# EAGLE design MF2015 Vertical (EAGLE 7.1.0)
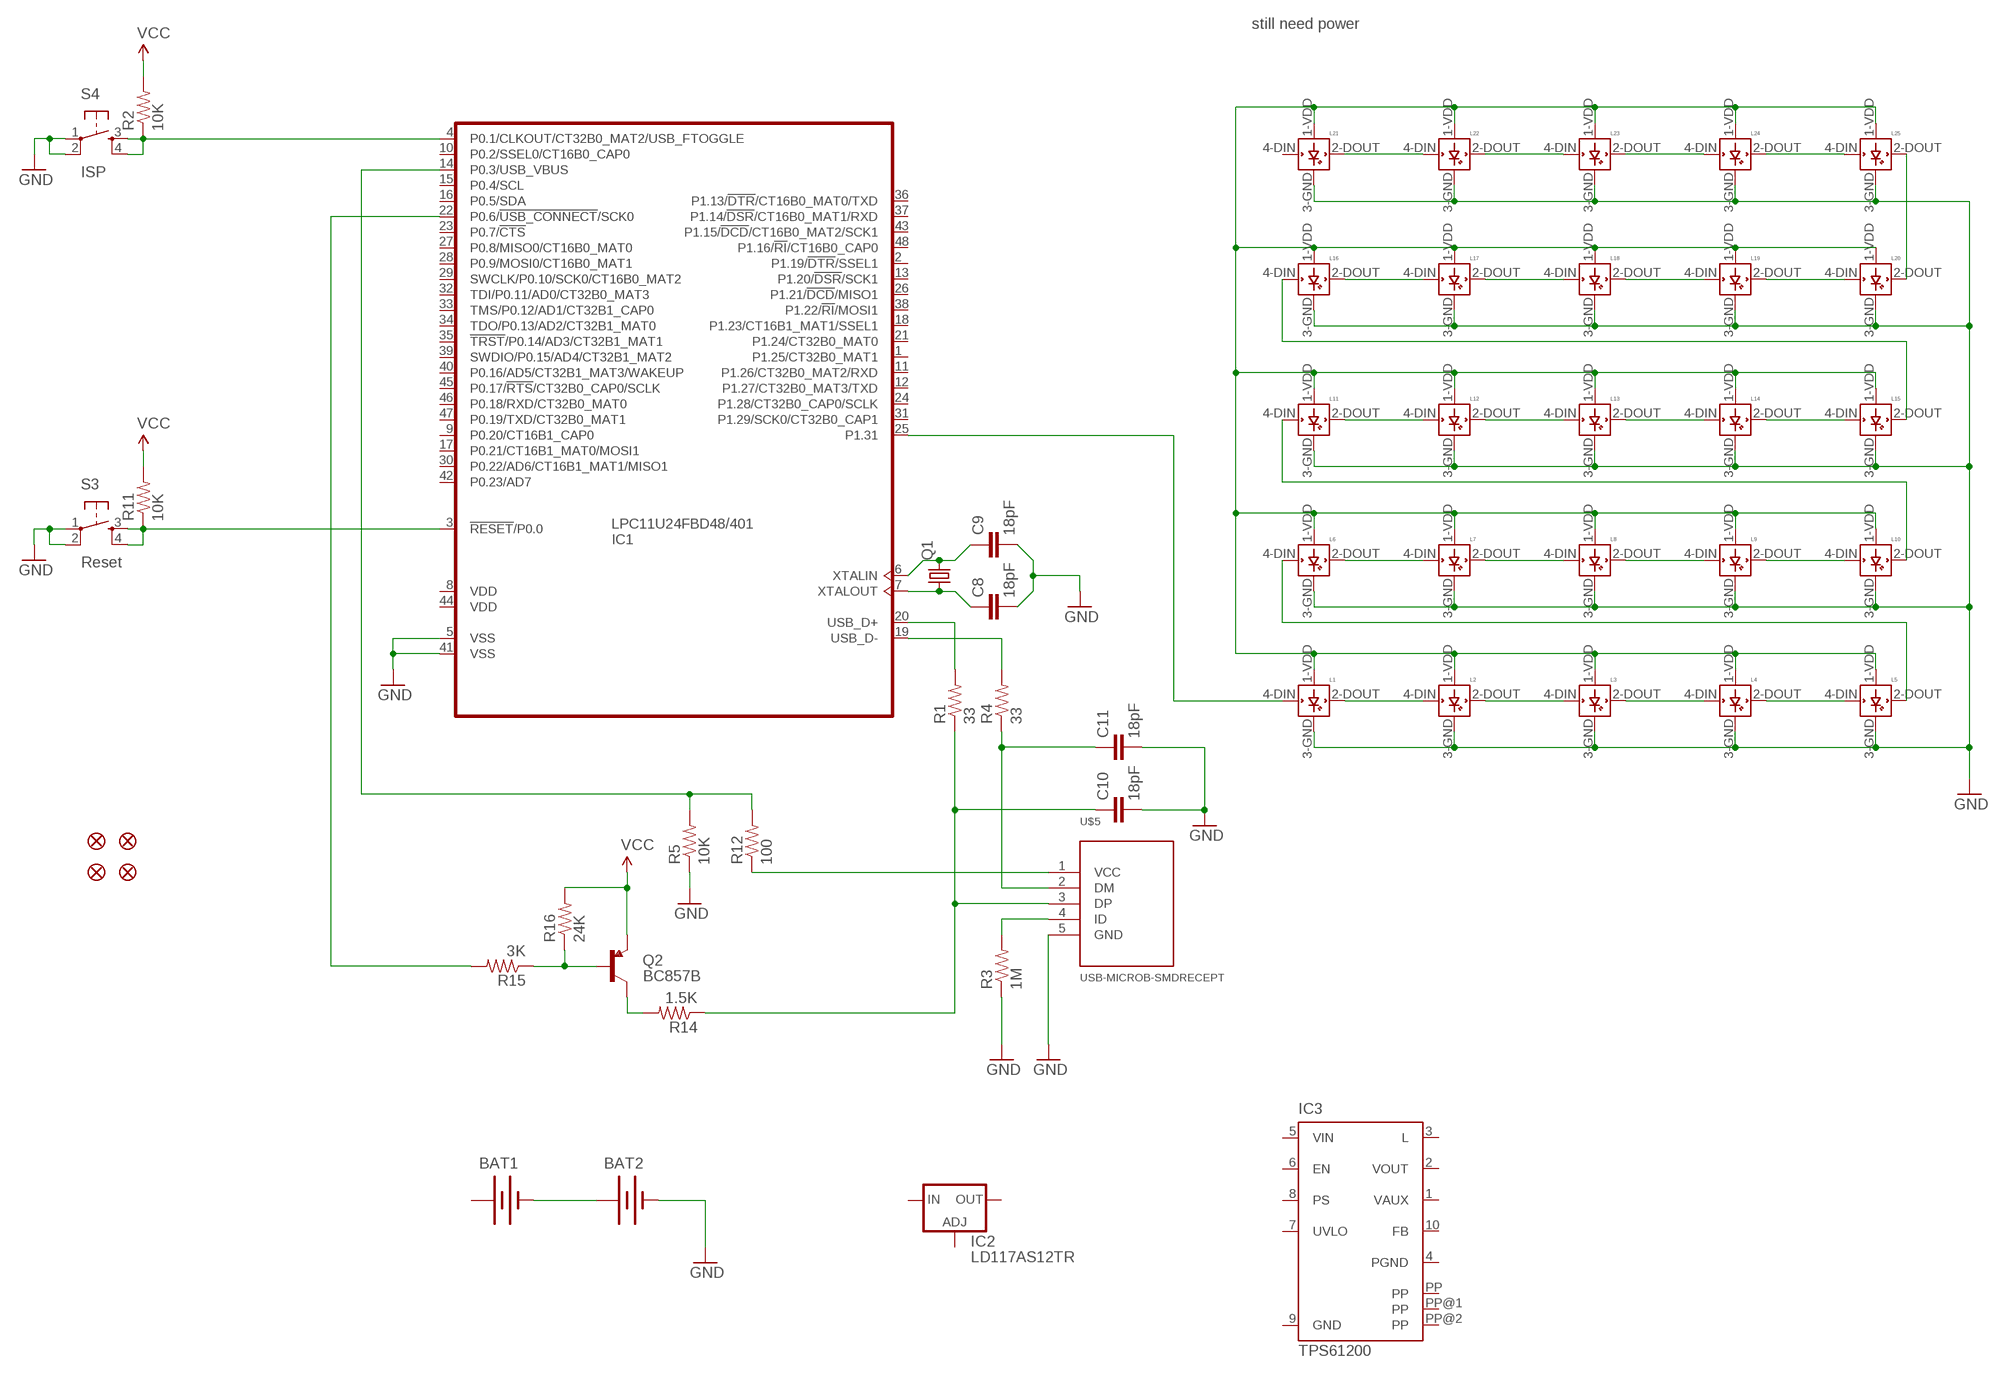
[diagram p0: schematic, sheet 1]

## Parts
BAT1  BATTERYAAA-KIT  [BATTERY-AAA-KIT]
BAT2  BATTERYAAA-KIT  [BATTERY-AAA-KIT]
C8  18pF  C-EUC0603  [C0603]
C9  18pF  C-EUC0603  [C0603]
C10  18pF  C-EUC0603  [C0603]
C11  18pF  C-EUC0603  [C0603]
FID1  FIDUCIAL1X2  [FIDUCIAL-1X2]
FID2  FIDUCIAL1X2  [FIDUCIAL-1X2]
FID3  FIDUCIAL1X2  [FIDUCIAL-1X2]
FID4  FIDUCIAL1X2  [FIDUCIAL-1X2]
IC1  LPC11U24FBD48/401  [LQFP48]
IC2  LD117AS12TR  [SOT223]
IC3  TPS61200  [S-PDSO-N10]
L1  WS2812B  [WS2812B]
L2  WS2812B  [WS2812B]
L3  WS2812B  [WS2812B]
L4  WS2812B  [WS2812B]
L5  WS2812B  [WS2812B]
L6  WS2812B  [WS2812B]
L7  WS2812B  [WS2812B]
L8  WS2812B  [WS2812B]
L9  WS2812B  [WS2812B]
L10  WS2812B  [WS2812B]
L11  WS2812B  [WS2812B]
L12  WS2812B  [WS2812B]
L13  WS2812B  [WS2812B]
L14  WS2812B  [WS2812B]
L15  WS2812B  [WS2812B]
L16  WS2812B  [WS2812B]
L17  WS2812B  [WS2812B]
L18  WS2812B  [WS2812B]
L19  WS2812B  [WS2812B]
L20  WS2812B  [WS2812B]
L21  WS2812B  [WS2812B]
L22  WS2812B  [WS2812B]
L23  WS2812B  [WS2812B]
L24  WS2812B  [WS2812B]
L25  WS2812B  [WS2812B]
Q1  CRYSTAL  [CRYSTAL-SMD-5X3.2-2PIN]
Q2  BC857B  TRANSISTOR_PNPSMD  [SOT23-3]
R1  33  R-US_R0603  [R0603]
R2  10K  R-US_R0603  [R0603]
R3  1M  R-US_R0603  [R0603]
R4  33  R-US_R0603  [R0603]
R5  10K  R-US_R0603  [R0603]
R11  10K  R-US_R0603  [R0603]
R12  100  R-US_R0603  [R0603]
R14  1.5K  R-US_R0603  [R0603]
R15  3K  R-US_R0603  [R0603]
R16  24K  R-US_R0603  [R0603]
S3  Reset  TAC_SWITCHSMD  [TACTILE_SWITCH_SMD]
S4  ISP  TAC_SWITCHSMD  [TACTILE_SWITCH_SMD]
U$5  USB-MICROB-SMDRECEPT  [USB-MICROB-RECEPT]

## Nets
GND: BAT2.GND@1(-) C8.2 C9.2 C10.2 C11.2 IC1.5(VSS) IC1.41(VSS) L1.3-GND(GND) L2.3-GND(GND) L3.3-GND(GND) L4.3-GND(GND) L5.3-GND(GND) L6.3-GND(GND) L7.3-GND(GND) L8.3-GND(GND) L9.3-GND(GND) L10.3-GND(GND) L11.3-GND(GND) L12.3-GND(GND) L13.3-GND(GND) L14.3-GND(GND) L15.3-GND(GND) L16.3-GND(GND) L17.3-GND(GND) L18.3-GND(GND) L19.3-GND(GND) L20.3-GND(GND) L21.3-GND(GND) L22.3-GND(GND) L23.3-GND(GND) L24.3-GND(GND) L25.3-GND(GND) R3.1 R5.1 S3.1 S3.2 S4.1 S4.2 U$5.5(GND)
N$1: L1.2-DOUT(DOUT) L2.4-DIN(DIN)
N$2: L2.2-DOUT(DOUT) L3.4-DIN(DIN)
N$3: L3.2-DOUT(DOUT) L4.4-DIN(DIN)
N$4: L4.2-DOUT(DOUT) L5.4-DIN(DIN)
N$5: L5.2-DOUT(DOUT) L6.4-DIN(DIN)
N$6: L6.2-DOUT(DOUT) L7.4-DIN(DIN)
N$7: L7.2-DOUT(DOUT) L8.4-DIN(DIN)
N$8: L8.2-DOUT(DOUT) L9.4-DIN(DIN)
N$9: L9.2-DOUT(DOUT) L10.4-DIN(DIN)
N$10: L10.2-DOUT(DOUT) L11.4-DIN(DIN)
N$11: L11.2-DOUT(DOUT) L12.4-DIN(DIN)
N$12: L12.2-DOUT(DOUT) L13.4-DIN(DIN)
N$13: L13.2-DOUT(DOUT) L14.4-DIN(DIN)
N$14: L14.2-DOUT(DOUT) L15.4-DIN(DIN)
N$15: L15.2-DOUT(DOUT) L16.4-DIN(DIN)
N$16: L16.2-DOUT(DOUT) L17.4-DIN(DIN)
N$17: L17.2-DOUT(DOUT) L18.4-DIN(DIN)
N$18: L18.2-DOUT(DOUT) L19.4-DIN(DIN)
N$19: L19.2-DOUT(DOUT) L20.4-DIN(DIN)
N$20: L20.2-DOUT(DOUT) L25.2-DOUT(DOUT)
N$21: L24.2-DOUT(DOUT) L25.4-DIN(DIN)
N$22: L23.2-DOUT(DOUT) L24.4-DIN(DIN)
N$23: L22.2-DOUT(DOUT) L23.4-DIN(DIN)
N$24: L21.2-DOUT(DOUT) L22.4-DIN(DIN)
N$25: C9.1 IC1.6(XTALIN) Q1.P$2
N$26: C8.1 IC1.7(XTALOUT) Q1.P$1
N$27: C10.1 R1.1 R14.1 U$5.3(DP)
N$28: IC1.4(P0.1/CLKOUT/CT32B0_MAT2/USB_FTOGGLE) R2.1 S4.3 S4.4
N$29: IC1.20(USB_D+) R1.2
N$30: IC1.3(!RESET!/P0.0) R11.1 S3.3 S3.4
N$31: IC1.19(USB_D-) R4.2
N$32: C11.1 R4.1 U$5.2(DM)
N$33: R12.1 U$5.1(VCC)
N$34: R3.2 U$5.4(ID)
N$35: Q2.1(B) R15.1 R16.1
N$36: Q2.3(C) R14.2
N$37: BAT1.GND@1(-) BAT2.PWR@1(+)
N$38: IC1.25(P1.31) L1.4-DIN(DIN)
N$45: L1.1-VDD(VDD) L2.1-VDD(VDD) L3.1-VDD(VDD) L4.1-VDD(VDD) L5.1-VDD(VDD) L6.1-VDD(VDD) L7.1-VDD(VDD) L8.1-VDD(VDD) L9.1-VDD(VDD) L10.1-VDD(VDD) L11.1-VDD(VDD) L12.1-VDD(VDD) L13.1-VDD(VDD) L14.1-VDD(VDD) L15.1-VDD(VDD) L16.1-VDD(VDD) L17.1-VDD(VDD) L18.1-VDD(VDD) L19.1-VDD(VDD) L20.1-VDD(VDD) L21.1-VDD(VDD) L22.1-VDD(VDD) L23.1-VDD(VDD) L24.1-VDD(VDD) L25.1-VDD(VDD)
USB_CONNECT: IC1.22(P0.6/!USB_CONNECT!/SCK0) R15.2
USB_VBUS: IC1.14(P0.3/USB_VBUS) R5.2 R12.2
VCC: Q2.2(E) R2.2 R11.2 R16.2
Unconnected: IC1.1(P1.25/CT32B0_MAT1) IC1.2(P1.19/!DTR!/SSEL1) IC1.8(VDD) IC1.9(P0.20/CT16B1_CAP0) IC1.10(P0.2/SSEL0/CT16B0_CAP0) IC1.11(P1.26/CT32B0_MAT2/RXD) IC1.12(P1.27/CT32B0_MAT3/TXD) IC1.13(P1.20/!DSR!/SCK1) IC1.15(P0.4/SCL) IC1.16(P0.5/SDA) IC1.17(P0.21/CT16B1_MAT0/MOSI1) IC1.18(P1.23/CT16B1_MAT1/SSEL1) IC1.21(P1.24/CT32B0_MAT0) IC1.23(P0.7/!CTS!) IC1.24(P1.28/CT32B0_CAP0/SCLK) IC1.26(P1.21/!DCD!/MISO1) IC1.27(P0.8/MISO0/CT16B0_MAT0) IC1.28(P0.9/MOSI0/CT16B0_MAT1) IC1.29(SWCLK/P0.10/SCK0/CT16B0_MAT2) IC1.30(P0.22/AD6/CT16B1_MAT1/MISO1) IC1.31(P1.29/SCK0/CT32B0_CAP1) IC1.32(TDI/P0.11/AD0/CT32B0_MAT3) IC1.33(TMS/P0.12/AD1/CT32B1_CAP0) IC1.34(TDO/P0.13/AD2/CT32B1_MAT0) IC1.35(!TRST!/P0.14/AD3/CT32B1_MAT1) IC1.36(P1.13/!DTR!/CT16B0_MAT0/TXD) IC1.37(P1.14/!DSR!/CT16B0_MAT1/RXD) IC1.38(P1.22/!RI!/MOSI1) IC1.39(SWDIO/P0.15/AD4/CT32B1_MAT2) IC1.40(P0.16/AD5/CT32B1_MAT3/WAKEUP) IC1.42(P0.23/AD7) IC1.43(P1.15/!DCD!/CT16B0_MAT2/SCK1) IC1.44(VDD) IC1.45(P0.17/!RTS!/CT32B0_CAP0/SCLK) IC1.46(P0.18/RXD/CT32B0_MAT0) IC1.47(P0.19/TXD/CT32B0_MAT1) IC1.48(P1.16/!RI!/CT16B0_CAP0) IC2.1(ADJ) IC2.3(IN) IC2.4(OUT) IC3.1(VAUX) IC3.2(VOUT) IC3.3(L) IC3.5(VIN) IC3.6(EN) IC3.7(UVLO) IC3.8(PS) IC3.10(FB) L21.4-DIN(DIN)

## Notes on the sheet
- still need power

## Power pins joined to a net without a drawn wire
+: BAT1.PWR@1(+)
GND: IC3.9(GND)
PGND: IC3.4(PGND)
PP: IC3.PP IC3.PP@1(PP) IC3.PP@2(PP)

## Library data of the parts
BAT1 BAT2 = SparkFun-Electromechanical:BATTERY: Battery Holders Various common sizes : AA, AAA, 18650 (PRT-12895), 20mm coin cell and 12mm coin cell. 20MM_4LEGS, BATT-10373; PROD_ID: BATT-08571
C8-C11 = rcl:C-EU: CAPACITOR, European symbol
FID1-FID4 = SparkFun-Aesthetics:FIDUCIAL: Fiducial Alignment Points Various fiducial points for machine vision alignment.
IC1 = lpc11u24fbd48:LPC11U24FBD48
IC2 = v-reg:LD117A?*: Low drop fixed and adjustable positive voltage regulators 1 A Source: http://www.st.com/stonline/products/literature/ds/7194/ld1117axx.pdf
IC3 = texas:TPS6120*: LOW INPUT VOLTAGE SYNCHRONOUS BOOST CONVERTER WITH 1.3-A SWITCHES Source: http://focus.ti.com/lit/ds/symlink/tps61200.pdf; MPN: TPS61200DRCT; OC_FARNELL: 1471238; OC_NEWARK: 37M0066
L1-L25 = adafruit:WS2812B
Q1 = JVN:CRYSTAL: Crystals Various standard crystals. Proven footprints. Spark Fun Electronics SKU : COM-00534
Q2 = SparkFun-DiscreteSemi:TRANSISTOR_PNP: Generic PNP BJT. Double check pinouts against datasheets- not all devices are the same!
R1-R5 R11 R12 R14-R16 = rcl:R-US_: RESISTOR, American symbol
S3 S4 = SparkFun-Electromechanical:TAC_SWITCH: Momentary Switch Button commonly used for reset or general input. Spark Fun Electronics SKU : COM-00097
U$5 = logxen:USB-MICROB-SMDRECEPT

## Board
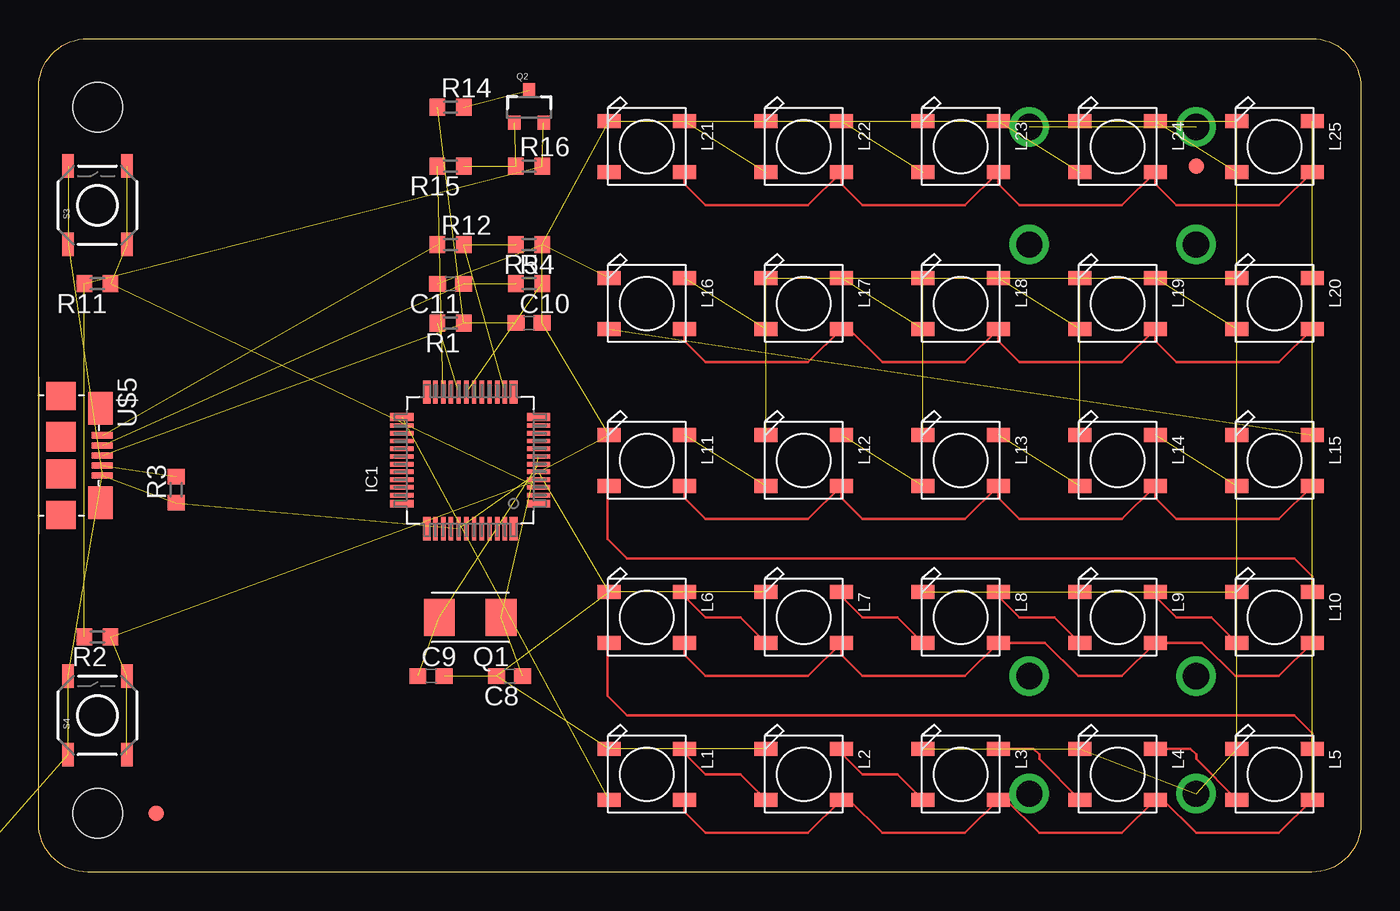
[diagram p1: board, top side]
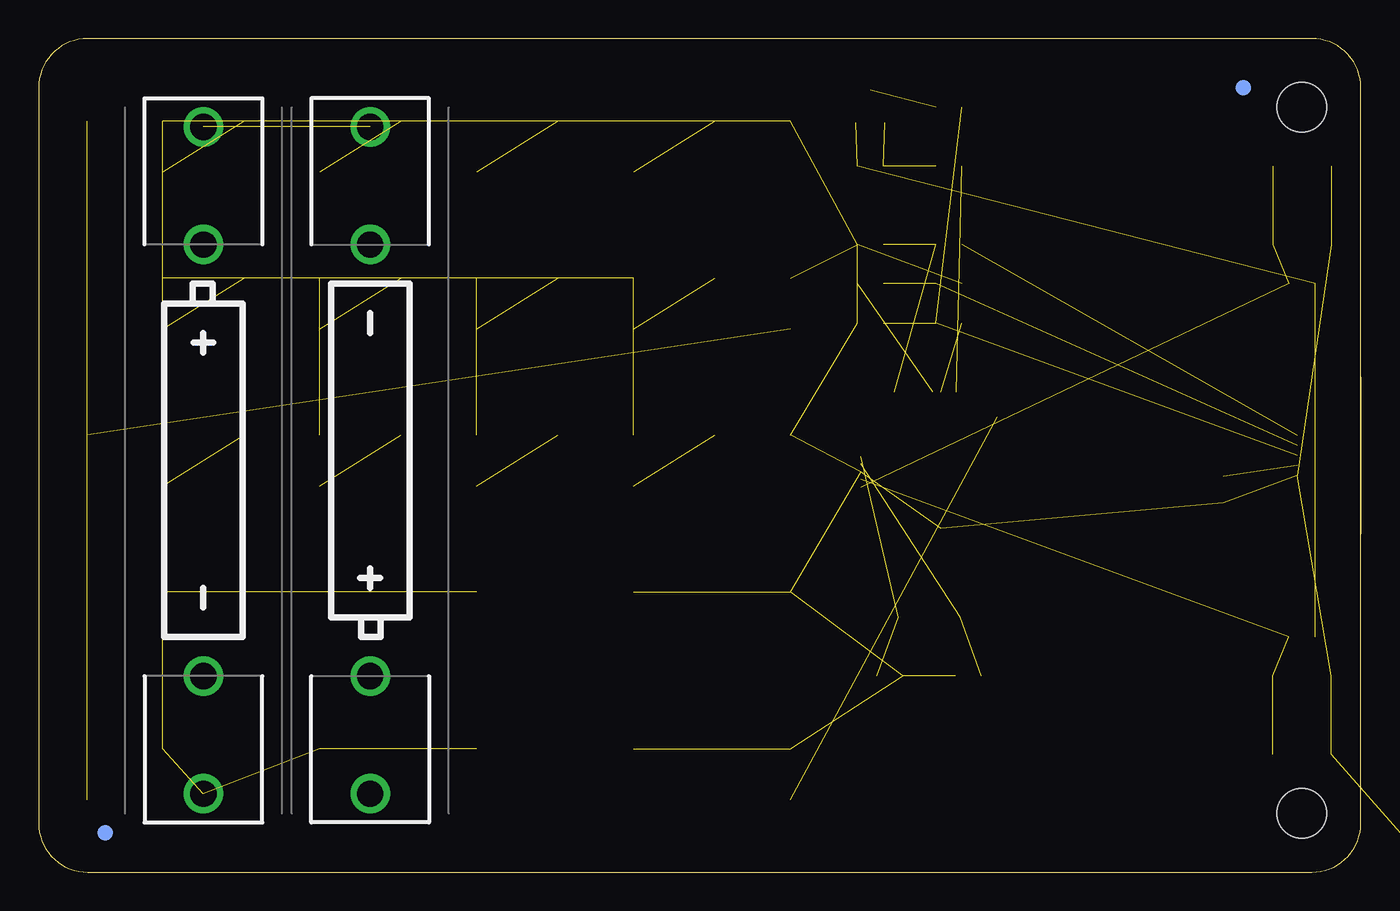
[diagram p2: board, bottom side, seen from below]

Size 85.6 x 53.98 mm. Coordinates in mm from the lower left corner, seen from the top.
Outline: 82.42,0 3.17,0 arc-90 0,3.17 0,50.8 arc-90 3.17,53.98 82.42,53.98 arc-90 85.6,50.8 85.6,3.17 arc-90 82.42,0
Copper layers (1*16): Top 0.035mm / dielectric 1.5mm / Bottom 0.035mm
Design rules "SeeedStudio_2layer_DRU_no_angle_20140221": minimum track width 6mil, minimum drill 12mil, track to track 6mil, track to pad 6mil, pad to pad 6mil, via to via 6mil, smd to smd 0mil, copper to edge 10mil, drill to drill 10mil, minimum pad ring 10mil, minimum via ring 6mil, stop-mask expansion 2mil, vias tented up to drill 100mil, thermal gap 10mil
Holes 3.2 mm at 3.81,3.81 3.81,49.53

### Footprints (pad centres in the part's own frame; a part is rotated, then mirrored left to right if it is on the bottom)
BATTERY-AAA-KIT = drill 1.702: GND@1 21.59,0; GND@2 13.97,0; PWR@1 -21.59,0; PWR@2 -13.97,0
C0603 = smd 1.1 x 1: 1 -0.85,0; 2 0.85,0
FIDUCIAL-1X2 = smd 1 x 1: 1 0,0
LQFP48 = smd 0.5 x 1.5: 1 -2.81,-4.425; 12 2.81,-4.425; 25 2.81,4.425; 36 -2.81,4.425 | smd 0.28 x 1.5: 2 -2.25,-4.425; 3 -1.75,-4.425; 4 -1.25,-4.425; 5 -0.75,-4.425; 6 -0.25,-4.425; 7 0.25,-4.425; 8 0.75,-4.425; 9 1.25,-4.425; 10 1.75,-4.425; 11 2.25,-4.425; 26 2.25,4.425; 27 1.75,4.425; 28 1.25,4.425; 29 0.75,4.425; 30 0.25,4.425; 31 -0.25,4.425; 32 -0.75,4.425; 33 -1.25,4.425; 34 -1.75,4.425; 35 -2.25,4.425 | smd 1.5 x 0.5: 13 4.425,-2.81; 24 4.425,2.81; 37 -4.425,2.81; 48 -4.425,-2.81 | smd 1.5 x 0.28: 14 4.425,-2.25; 15 4.425,-1.75; 16 4.425,-1.25; 17 4.425,-0.75; 18 4.425,-0.25; 19 4.425,0.25; 20 4.425,0.75; 21 4.425,1.25; 22 4.425,1.75; 23 4.425,2.25; 38 -4.425,2.25; 39 -4.425,1.75; 40 -4.425,1.25; 41 -4.425,0.75; 42 -4.425,0.25; 43 -4.425,-0.25; 44 -4.425,-0.75; 45 -4.425,-1.25; 46 -4.425,-1.75; 47 -4.425,-2.25
SOT223 = smd 1.5 x 2: 1 -2.3,-3.15; 2 0,-3.15; 3 2.3,-3.15 | smd 3.8 x 2: 4 0,3.15
S-PDSO-N10 = smd 0.28 x 0.85: 1 -1,-1.475; 2 -0.5,-1.475; 3 0,-1.475; 4 0.5,-1.475; 5 1,-1.475; 6 1,1.475; 7 0.5,1.475; 8 0,1.475; 9 -0.5,1.475; 10 -1,1.475 | smd 2.4 x 1.65: PP 0,0 | smd 3.8 x 0.28: PP@1 0,0.275; PP@2 0,-0.275
WS2812B = smd 1.5 x 0.9: 1-VDD 2.45,-1.65; 2-DOUT 2.45,1.65; 3-GND -2.45,1.65; 4-DIN -2.45,-1.65
CRYSTAL-SMD-5X3.2-2PIN = smd 2 x 2.4: P$1 -2,0; P$2 2,0
SOT23-3 = smd 0.8 x 0.9: 1 -0.95,-1; 2 0.95,-1; 3 0,1.1
R0603 = smd 1 x 1.1: 1 -0.85,0; 2 0.85,0
TACTILE_SWITCH_SMD = smd 1.524 x 0.762: 1 -2.54,1.905; 2 2.54,1.905; 3 -2.54,-1.905; 4 2.54,-1.905
USB-MICROB-RECEPT = smd 0.4 x 1.35: 1 -1.3,4.125; 2 -0.65,4.125; 3 0,4.125; 4 0.65,4.125; 5 1.3,4.125 | smd 2.1 x 1.6: P$1 3.05,4; P$2 -3.05,4 | smd 1.8 x 1.9: P$3 -3.85,1.45; P$4 3.85,1.45 | smd 1.9 x 1.9: P$5 -1.2,1.45; P$6 1.2,1.45

### Placement (x,y rotation side)
BAT1  64.14,26.67 90 bottom
BAT2  74.93,26.67 270 bottom
C8  30.48,12.7 180 top
C9  25.4,12.7 0 top
C10  31.75,35.56 0 top
C11  26.67,38.1 180 top
FID1  7.62,3.81 0 top
FID2  74.93,45.72 0 top
FID3  7.62,50.8 0 bottom
FID4  81.28,2.54 0 bottom
IC1  27.94,26.67 90 top
IC2  -6.35,5.08 0 top  (outside the outline)
IC3  -6.35,-3.81 0 top  (outside the outline)
L1  39.37,6.35 0 top
L2  49.53,6.35 0 top
L3  59.69,6.35 0 top
L4  69.85,6.35 0 top
L5  80.01,6.35 0 top
L6  39.37,16.51 0 top
L7  49.53,16.51 0 top
L8  59.69,16.51 0 top
L9  69.85,16.51 0 top
L10  80.01,16.51 0 top
L11  39.37,26.67 0 top
L12  49.53,26.67 0 top
L13  59.69,26.67 0 top
L14  69.85,26.67 0 top
L15  80.01,26.67 0 top
L16  39.37,36.83 0 top
L17  49.53,36.83 0 top
L18  59.69,36.83 0 top
L19  69.85,36.83 0 top
L20  80.01,36.83 0 top
L21  39.37,46.99 0 top
L22  49.53,46.99 0 top
L23  59.69,46.99 0 top
L24  69.85,46.99 0 top
L25  80.01,46.99 0 top
Q1  27.94,16.51 180 top
Q2  31.75,49.53 0 top
R1  26.67,35.56 180 top
R2  3.81,15.24 180 top
R3  8.89,24.77 90 top
R4  31.75,38.1 0 top
R5  31.75,40.64 180 top
R11  3.81,38.1 180 top
R12  26.67,40.64 0 top
R14  26.67,49.53 0 top
R15  26.67,45.72 180 top
R16  31.75,45.72 0 top
S3  3.81,43.18 90 top
S4  3.81,10.16 90 top
U$5  0,26.99 270 top

### Tracks (layer width: path | path; a pad name or v marks a point on that pad's centre or on a via)
GND  (39 unrouted)
N$1
  Top 0.152: L1.2-DOUT 41.82,7.71 43.18,6.35 45.43,6.35 L2.4-DIN
N$2
  Top 0.152: L2.2-DOUT 51.98,7.71 53.34,6.35 55.59,6.35 L3.4-DIN
N$3
  Top 0.152: L3.2-DOUT 64.39,8 64.77,7.62 64.77,7.33 L4.4-DIN
N$4
  Top 0.152: L4.2-DOUT 74.55,8 74.93,7.62 74.93,7.33 L5.4-DIN
N$5
  Top 0.152: L5.2-DOUT 82.46,8.98 81.28,10.16 38.1,10.16 36.83,11.43 36.83,14.77 L6.4-DIN
N$6
  Top 0.152: L6.2-DOUT 41.82,17.87 43.18,16.51 45.43,16.51 L7.4-DIN
N$7
  Top 0.152: L7.2-DOUT 51.98,17.87 53.34,16.51 55.59,16.51 L8.4-DIN
N$8
  Top 0.152: L8.2-DOUT 62.14,17.87 63.5,16.51 65.75,16.51 L9.4-DIN
N$9
  Top 0.152: L9.2-DOUT 72.3,17.87 73.66,16.51 75.91,16.51 L10.4-DIN
N$10
  Top 0.152: L10.2-DOUT 82.46,19.14 81.28,20.32 38.1,20.32 36.83,21.59 36.83,24.93 L11.4-DIN
N$11  (1 unrouted)
N$12  (1 unrouted)
N$13  (1 unrouted)
N$14  (1 unrouted)
N$15  (1 unrouted)
N$16  (1 unrouted)
N$17  (1 unrouted)
N$18  (1 unrouted)
N$19  (1 unrouted)
N$20  (1 unrouted)
N$21  (1 unrouted)
N$22  (1 unrouted)
N$23  (1 unrouted)
N$24  (1 unrouted)
N$25  (2 unrouted)
N$26  (2 unrouted)
N$27  (3 unrouted)
N$28  (3 unrouted)
N$29  (1 unrouted)
N$30  (3 unrouted)
N$31  (1 unrouted)
N$32  (2 unrouted)
N$33  (1 unrouted)
N$34  (1 unrouted)
N$35  (2 unrouted)
N$36  (1 unrouted)
N$37  (1 unrouted)
N$38  (1 unrouted)
N$45  (4 unrouted)
  Top 0.152: L1.1-VDD 41.82,3.9 43.18,2.54 49.82,2.54 L2.1-VDD 52.45,4.7 54.61,2.54 59.98,2.54 L3.1-VDD 62.61,4.7 64.77,2.54 70.14,2.54 L4.1-VDD 72.77,4.7 74.93,2.54 80.3,2.54 L5.1-VDD | L6.1-VDD 41.82,14.06 43.18,12.7 49.82,12.7 L7.1-VDD 51.98,14.06 53.34,12.7 59.98,12.7 L8.1-VDD 65.15,14.86 67.31,12.7 70.14,12.7 L9.1-VDD 75.31,14.86 77.47,12.7 80.3,12.7 L10.1-VDD | L11.1-VDD 41.82,24.22 43.18,22.86 49.82,22.86 L12.1-VDD 51.98,24.22 53.34,22.86 59.98,22.86 L13.1-VDD 62.14,24.22 63.5,22.86 70.14,22.86 L14.1-VDD 72.3,24.22 73.66,22.86 80.3,22.86 L15.1-VDD | L16.1-VDD 41.82,34.38 43.18,33.02 49.82,33.02 L17.1-VDD 52.45,35.18 54.61,33.02 59.98,33.02 L18.1-VDD 62.14,34.38 63.5,33.02 70.14,33.02 L19.1-VDD 72.3,34.38 73.66,33.02 80.3,33.02 L20.1-VDD | L21.1-VDD 41.82,44.54 43.18,43.18 49.82,43.18 L22.1-VDD 51.98,44.54 53.34,43.18 59.98,43.18 L23.1-VDD 62.14,44.54 63.5,43.18 70.14,43.18 L24.1-VDD 72.3,44.54 73.66,43.18 80.3,43.18 L25.1-VDD
PP  (2 unrouted)
USB_CONNECT  (1 unrouted)
USB_VBUS  (2 unrouted)
VCC  (3 unrouted)

### Text on the board
Dimension: * FIDS are missing keepout